# Altium schematic sheet external_LD_mounting.SchDoc: External Laser Mounting PCB
size A4; Author: Peter Tanner; SheetNumber: 9; SheetTotal: 9
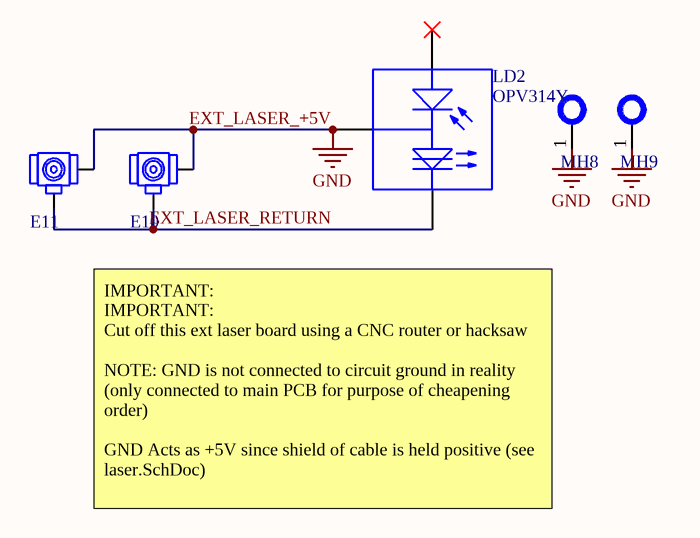
[diagram p0: external_LD_mounting.SchDoc]

## Parts
E10  U.FL-R-SMT-1(01)  [HRS-U.FL-R-SMT-3_V 4_LAYER_KO]  (value not drawn)
E11  U.FL-R-SMT-1(01)  [HRS-U.FL-R-SMT-3_V 4_LAYER_KO]  (value not drawn)
LD2  OPV314Y  [LASER_TO-18]
MH8  Mounting hole M3  [Mounting hole M3-Footprint-1]  (value not drawn)  (no BOM)
MH9  Mounting hole M3  [Mounting hole M3-Footprint-1]  (value not drawn)  (no BOM)

## Nets
EXT_LASER_+5V: E10.2(GND) E11.2(GND) LD2.2(COM) MH8.1 MH9.1  [also labelled GND]
EXT_LASER_RETURN: E10.1(SIG) E11.1(SIG) LD2.1(LD_K)

Not connected (* = marked no-connect by the designer): LD2 3(PD_A)*

## Notes on the sheet
- IMPORTANT:
  IMPORTANT:
  Cut off this ext laser board using a CNC router or hacksaw
  NOTE: GND is not connected to circuit ground in reality (only connected to main PCB for purpose of cheapening order)
  GND Acts as +5V since shield of cable is held positive (see laser.SchDoc)
- Title:
- Designer:
- Date:
- Size:
- Revision:
- A4
- Sheet:
- 35 Stirling Hwy, Perth WA 6009, Australia

## Library data of the parts
E10 E11 = CMP-00380-18: Rf Connectors / Coaxial Connectors SMT Ml Rec Au 50 Ohm W/anti Sldr Wicking UFL; Number of Ports: 1; Dielectric Material: Polymer; Impedance: 50; Mating Cycles: 30; Connector Type: Receptacle,Male Pin; Body Plating: Silver; Center Contact Plating: Gold; Max Frequency: 6GHz; Body Material: Bronze; Lead Free: Lead Free; Series: U.FL; JLC PN: C88374; Contact Material: Brass; Fastening Type: SNAP-ON; Min Operating Temperature: -40°C; RoHS Compliant: Yes; Housing Color: Beige; Depth: 3mm; Contact Plating: Gold; Mount: Surface Mount; Length: 3.1mm; Orientation: Vertical; Termination: Solder; Max Operating Temperature: 90°C; Source: UWAA_Stock
LD2 = CMP-00026-00000-5: VCSEL Emitter, 840nm Min, 860nm Max, 2500Mbps, TO-46, Through Hole Mount; Max Supply Voltage: 2.2V; Supply Current: 15mA; Body Height: 3.66mm; Operating Wavelength-Nom: 850nm; Threshold Current-Min: 3mA; Body Length or Diameter: 4.67mm; Transmission Type: Digital; Fall Time-Max: 0.1ns; Min Supply Voltage: 1.6V; Spectral Width: 0.85nm; Built-in Feature: MONITOR PHOTODIODE; Number of Channels: 1; Min Operating Temperature: 0°C; Max Operating Temperature: 70°C; Data Rate: 2500Mbps; Package Style: TO-46Meter; RoHS Compliant: Yes; Reach SVHC Compliant: Yes; Operating Wavelength-Max: 860nm; Mounting Technology: Through Hole; Operating Wavelength-Min: 840nm; Fiber Optic Device Type: VCSEL EMITTER; Rise Time: 0.1ns; Source: Distributor
MH8 MH9 = CMP-00600-10: Close fit Di3.2 mm Alt: M3 nut flange